# EAGLE schematic Rocekt_test_stand_2.0 (EAGLE 9.5.2)
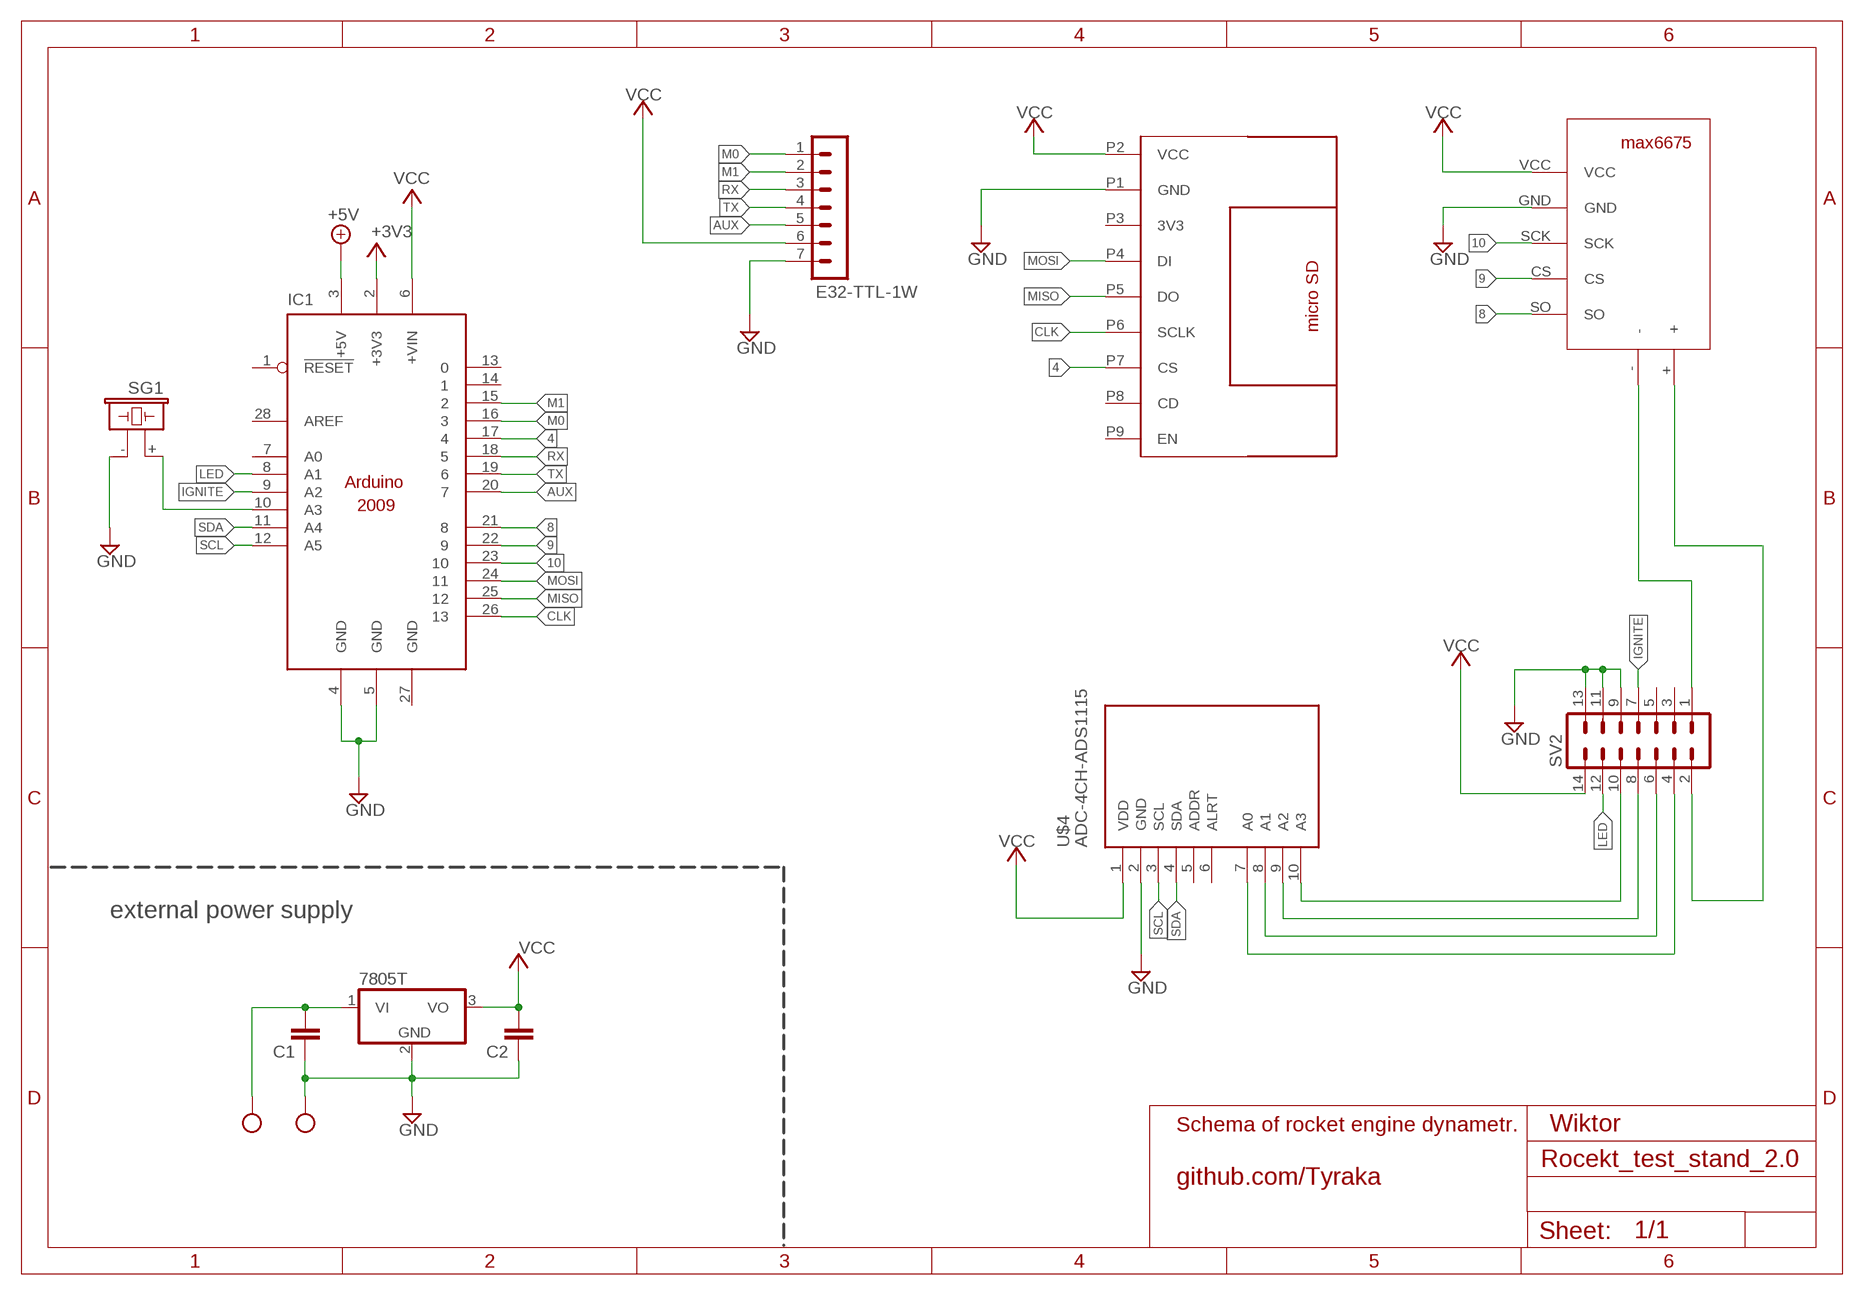
[diagram p0: schematic, sheet 1]

## Parts
C1  C2.5/4  [C2.5-4]
C2  C2.5/4  [C2.5-4]
E32-TTL-1W  MA07-1  [MA07-1]
IC1  ARDUINO2009_10  [ARDUINO2009]
IC2  7805T  [TO220H]
SD1  MICRO_SD  [MICRO_SD]
SG1  F/CM12P  [F/CM12P]
SV2  ML14  [ML14]
U$2  MAX6675  [MAX6675_FOOTPRINT]
U$4  ADC-4CH-ADS1115  [ADC-4CH-ADS1115]
X1  AK300/2  [AK300/2]

## Nets
4: IC1.17 SD1.P7(CS)
8: IC1.21 U$2.SO
9: IC1.22 U$2.CS
10: IC1.23 U$2.SCK
+3V3: IC1.2(+3V3)
+5V: IC1.3(+5V)
AUX: E32-TTL-1W.5 IC1.20
CLK: IC1.26 SD1.P6(SCLK)
GND: C1.1 C2.1 E32-TTL-1W.7 IC1.4(GND) IC1.5(GND) IC2.2(GND) SD1.P1(GND) SG1.- SV2.9 SV2.11 SV2.13 U$2.GND U$4.2(GND) X1.2
IGNITE: IC1.9(A2) SV2.7
LED: IC1.8(A1) SV2.12
M0: E32-TTL-1W.1 IC1.16
M1: E32-TTL-1W.2 IC1.15
MISO: IC1.25 SD1.P5(DO)
MOSI: IC1.24 SD1.P4(DI)
N$1: SV2.2 U$2.+
N$2: IC1.10(A3) SG1.+
N$3: SV2.1 U$2.-
N$4: SV2.4 U$4.7(A0)
N$5: SV2.10 U$4.10(A3)
N$6: SV2.8 U$4.9(A2)
N$7: SV2.6 U$4.8(A1)
N$8: C1.2 IC2.1(VI) X1.1
RX: E32-TTL-1W.3 IC1.18
SCL: IC1.12(A5) U$4.3(SCL)
SDA: IC1.11(A4) U$4.4(SDA)
TX: E32-TTL-1W.4 IC1.19
VCC: C2.2 E32-TTL-1W.6 IC1.6(+VIN) IC2.3(VO) SD1.P2(VCC) SV2.14 U$2.VCC U$4.1(VDD)
Unconnected: IC1.1(!RESET) IC1.7(A0) IC1.13 IC1.14 IC1.28(AREF) SD1.P3(3V3) SD1.P8(CD) SD1.P9(EN) SV2.3 SV2.5 U$4.5(ADDR) U$4.6(ALRT)

## Notes on the sheet
- external power supply
- Schema of rocket engine dynametr. | Wiktor
- github.com/Tyraka

## Power pins joined to a net without a drawn wire
GND: IC1.27(GND)

## Library data of the parts
C1 C2 = capacitor-wima:C: CAPACITOR naming: grid - package width
E32-TTL-1W = con-lstb:MA07-1: PIN HEADER; OC_FARNELL: unknown; OC_NEWARK: unknown
IC1 = arduino:ARDUINO2009_1: The Arduino Duemilanove ("2009") is a microcontroller board based on the ATmega168 or ATmega328. - 14 digital input/output pins (of which 6 can be used as PWM outputs) - 6 analog inputs, a 16 MHz crystal oscillator - USB connection - power jack - ISP header - reset button It contains everything needed to support the microcontroller; simply connect it to a computer with a USB cable or power it with a AC-to-DC adapter or battery to get started http://arduino.cc/en/Main/ArduinoBoardDuemilanove
IC2 = linear:78*: Positive VOLTAGE REGULATOR Source: http://cache.national.com/ds/LM/LM78L05.pdf http://www.fairchildsemi.com/ds/LM/LM7805.pdf
SD1 = 111_microsd:MICRO_SD
SG1 = buzzer:F/CM12P: BUZZER Source: Buerklin; OC_FARNELL: unknown; OC_NEWARK: unknown
SV2 = con-harting-ml:ML14: HARTING; OC_FARNELL: unknown; OC_NEWARK: unknown
U$2 = 111_max6675:MAX6675
U$4 = ads1115:ADC-4CH-ADS1115: 4 Channel 16-Bit Analog-to-Digital Converter based on ADS1115 chip Arduino ADS1115 Getting Started Tutorial is available here: http://henrysbench.capnfatz.com/henrys-bench/arduino-voltage-measurements/arduino-ads1115-module-getting-started-tutorial/ ADS1115 datasheet is available here: http://www.ti.com/lit/ds/symlink/ads1115.pdf Click here to find device on ebay.com <http://www.ebay.com/sch/ads1115+module>
X1 = con-ptr500:AK300/2: CONNECTOR; OC_FARNELL: unknown; OC_NEWARK: unknown